# Altium schematic sheet main.SCHDOC
size B
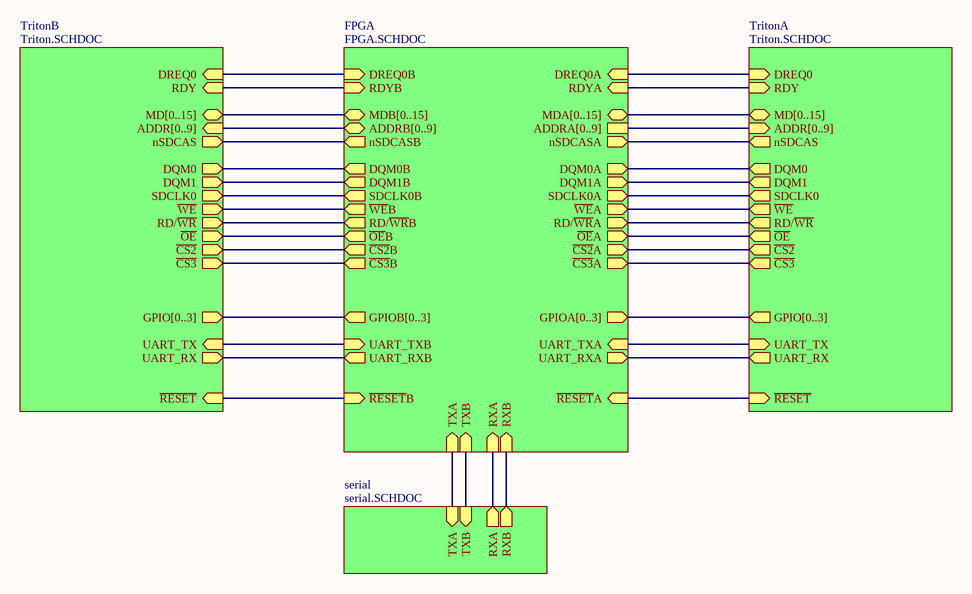
[diagram p0: main.SCHDOC]

## Sub-sheets
FPGA = FPGA.SCHDOC: DQM0A (out), DQM1A (out), SDCLK0A (out), DREQ0A (in), RDYA (in), ~{WE}A (out), RD/~{WR}A (out), ~{OE}A (out), ~{CS2}A (out), ~{CS3}A (out), nSDCASA (out), ADDRA[0..9], MDA[0..15] (bidir), ~{RESET}A (in), GPIOA[0..3] (out), UART_RXA (out), UART_TXA (in), RDYB (in), ~{WE}B (out), RD/~{WR}B (out), ~{OE}B (out), ~{CS2}B (out), ~{CS3}B (out), nSDCASB (out), SDCLK0B (out), DQM0B (out), DQM1B (out), DREQ0B (in), ~{RESET}B (in), GPIOB[0..3] (out), UART_RXB (out), UART_TXB (in), MDB[0..15] (bidir), ADDRB[0..9] (bidir), TXA (in), TXB (in), RXA (in), RXB (in)
serial = serial.SCHDOC: TXA (in), TXB (in), RXA (out), RXB (out)
TritonA = Triton.SCHDOC: ~{RESET} (in), DQM0 (out), DQM1 (out), SDCLK0 (out), DREQ0 (in), RDY (in), ~{WE} (out), RD/~{WR} (out), ~{OE} (out), ~{CS2} (out), ~{CS3} (out), nSDCAS (out), GPIO[0..3] (out), UART_RX (out), UART_TX (in), MD[0..15] (bidir), ADDR[0..9] (in)
TritonB = Triton.SCHDOC: ~{RESET} (in), DQM0 (out), DQM1 (out), SDCLK0 (out), DREQ0 (in), RDY (in), ~{WE} (out), RD/~{WR} (out), ~{OE} (out), ~{CS2} (out), ~{CS3} (out), nSDCAS (out), GPIO[0..3] (out), UART_RX (out), UART_TX (in), MD[0..15] (bidir), ADDR[0..9] (in)

## Nets
(unnamed): sheet FPGA/DQM0A, sheet TritonA/DQM0
(unnamed): sheet FPGA/DQM1A, sheet TritonA/DQM1
(unnamed): sheet FPGA/SDCLK0A, sheet TritonA/SDCLK0
(unnamed): sheet FPGA/DREQ0A, sheet TritonA/DREQ0
(unnamed): sheet FPGA/RDYA, sheet TritonA/RDY
(unnamed): sheet FPGA/~{WE}A, sheet TritonA/~{WE}
(unnamed): sheet FPGA/RD/~{WR}A, sheet TritonA/RD/~{WR}
(unnamed): sheet FPGA/~{OE}A, sheet TritonA/~{OE}
(unnamed): sheet FPGA/~{CS2}A, sheet TritonA/~{CS2}
(unnamed): sheet FPGA/~{CS3}A, sheet TritonA/~{CS3}
(unnamed): sheet FPGA/nSDCASA, sheet TritonA/nSDCAS
(unnamed): sheet FPGA/~{RESET}A, sheet TritonA/~{RESET}
(unnamed): sheet FPGA/UART_RXA, sheet TritonA/UART_RX
(unnamed): sheet FPGA/UART_TXA, sheet TritonA/UART_TX
(unnamed): sheet FPGA/RDYB, sheet TritonB/RDY
(unnamed): sheet FPGA/~{WE}B, sheet TritonB/~{WE}
(unnamed): sheet FPGA/RD/~{WR}B, sheet TritonB/RD/~{WR}
(unnamed): sheet FPGA/~{OE}B, sheet TritonB/~{OE}
(unnamed): sheet FPGA/~{CS2}B, sheet TritonB/~{CS2}
(unnamed): sheet FPGA/~{CS3}B, sheet TritonB/~{CS3}
(unnamed): sheet FPGA/nSDCASB, sheet TritonB/nSDCAS
(unnamed): sheet FPGA/SDCLK0B, sheet TritonB/SDCLK0
(unnamed): sheet FPGA/DQM0B, sheet TritonB/DQM0
(unnamed): sheet FPGA/DQM1B, sheet TritonB/DQM1
(unnamed): sheet FPGA/DREQ0B, sheet TritonB/DREQ0
(unnamed): sheet FPGA/~{RESET}B, sheet TritonB/~{RESET}
(unnamed): sheet FPGA/UART_RXB, sheet TritonB/UART_RX
(unnamed): sheet FPGA/UART_TXB, sheet TritonB/UART_TX
(unnamed): sheet FPGA/TXA, sheet serial/TXA
(unnamed): sheet FPGA/TXB, sheet serial/TXB
(unnamed): sheet FPGA/RXA, sheet serial/RXA
(unnamed): sheet FPGA/RXB, sheet serial/RXB

## Buses and harness runs
bus sheet FPGA/ADDRA[0..9] = sheet TritonA/ADDR[0..9]
bus sheet FPGA/ADDRB[0..9] = sheet TritonB/ADDR[0..9]
bus sheet FPGA/GPIOA[0..3] = sheet TritonA/GPIO[0..3]
bus sheet FPGA/GPIOB[0..3] = sheet TritonB/GPIO[0..3]
bus sheet FPGA/MDA[0..15] = sheet TritonA/MD[0..15]
bus sheet FPGA/MDB[0..15] = sheet TritonB/MD[0..15]